# Altium schematic sheet TopLevel.SchDoc
size A4
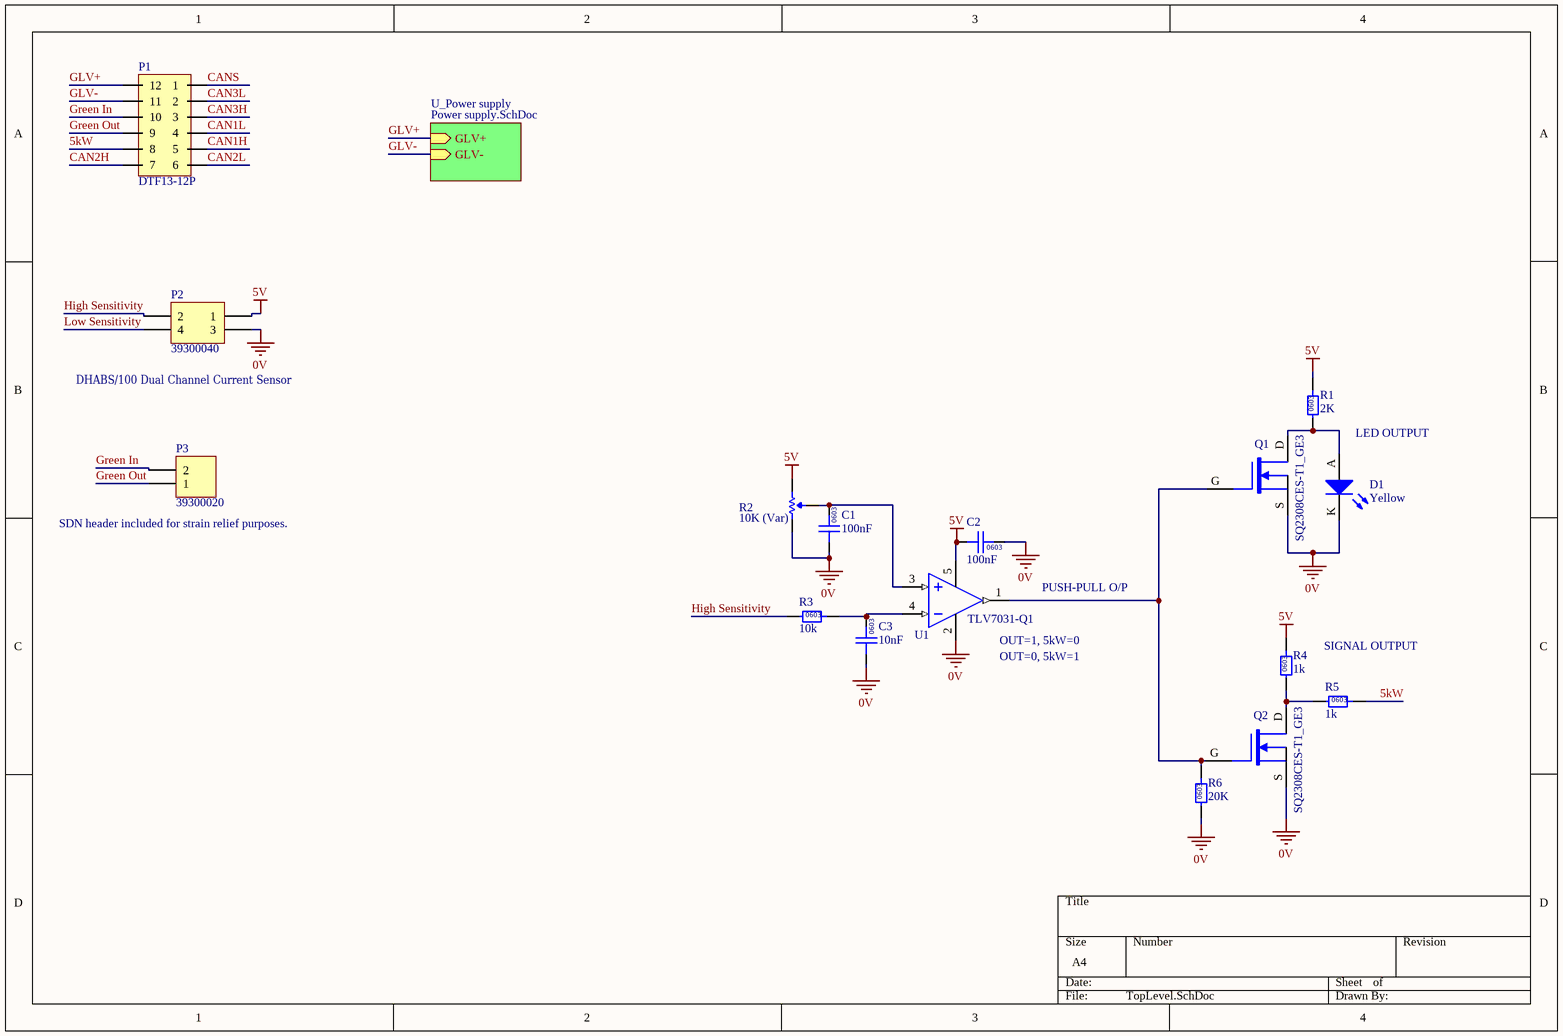
[diagram p0: TopLevel.SchDoc]

## Parts
C1  100nF  [0603]
C2  100nF  [0603]
C3  10nF  [0603]
D1  Yellow  [0805 LED]
P1  DTF13-12P  [DTF13-12P]
P2  39300040  [39300040]
P3  39300020  [39300020]
Q1  SQ2308CES-T1_GE3  [VSHY SOT-23-3]
Q2  SQ2308CES-T1_GE3  [VSHY SOT-23-3]
R1  2K  [0603]
R2  10K (Var)  [B 3296]
R3  10k  [0603]
R4  1k  [0603]
R5  1k  [0603]
R6  20K  [0603]
U1  TLV7031-Q1  [TI SOT-23-5]

## Sub-sheets
U_Power supply = Power supply.SchDoc: GLV+ (in), GLV- (in)

## Nets
0V: C1.1 C2.2 C3.1 D1.K P2.3 Q1.S Q2.S R2.3(CW) R6.1 U1.2(V-)
5V: C2.1 P2.1 R1.2 R2.1(CCW) R4.2 U1.5(Vcc)
5kW: P1.8 R5.2
CAN1H: P1.5
CAN1L: P1.4
CAN2H: P1.7
CAN2L: P1.6
CAN3H: P1.3
CAN3L: P1.2
CANS: P1.1
GLV+: P1.12 ; sheet U_Power supply/GLV+
GLV-: P1.11 ; sheet U_Power supply/GLV-
Green In: P1.10 P3.2
Green Out: P1.9 P3.1
High Sensitivity: P2.2 R3.1
Low Sensitivity: P2.4
NetC1_2: C1.2 R2.2(Wiper) U1.3(IN+)
NetC3_2: C3.2 R3.2 U1.4(IN-)
NetD1_A: D1.A Q1.D R1.1
NetQ1_G: Q1.G Q2.G R6.2 U1.1(OUT)
NetQ2_D: Q2.D R4.1 R5.1

## Notes on the sheet
- (near P2) DHAB​​S/100 Dual Channel Current Sensor
- LED OUTPUT
- (near P3) SDN header included for strain relief purposes.
- (near U1) OUT=1, 5kW=0
- PUSH-PULL O/P
- SIGNAL OUTPUT
- (near U1) OUT=0, 5kW=1
- (in symbol GCM188L81H103KA03D) 0603
- (in symbol GCM188L81H104KA57D) 0603
- (in symbol RC0603FR-071KL) 0603
- (in symbol RC0603FR-072KL) 0603
- (in symbol RC0603FR-0710KL) 0603
- (in symbol RC0603FR-0720KL) 0603

## Library data of the parts
C1 C2 = GCM188L81H104KA57D: Manufacturer: muRata; Rated Voltage: 50V; Tolerance: ±10%; Material: MLCC; Temperature Rating: X8L; Part Number: GCM188L81H104KA57D; Value: 100nF; Digikey Part Number: 490-6049-1-ND
C3 = GCM188L81H103KA03D: Manufacturer: muRata; Rated Voltage: 50V; Tolerance: ±10%; Material: MLCC; Temperature Rating: X8L; Part Number: GCM188L81H103KA03D; Value: 10nF; Digikey Part Number: 490-GCM188L81H103KA03DCT-ND
D1 = SML-211YTT86: Yellow LED Indication - Discrete 1.75V 0805 (2012 Metric); Manufacturer: ROHM Semiconductor; Part Number: SML-211YTT86; Colour: Yellow; Digikey Part Number: 511-1293-1-ND
P1 = DTF13-12P: Positions: 12; Pitch: 4.45mm; Angle: 90; Flange: No; Contact: Copper Alloy; Part Number: DTF13-12P; Row Spacing: 4.45mm; Digikey Part Number: 1734-1861-ND; Digikey Link: https://www.digikey.com/products/en?keywords=dtf13-12pa
P2 = 39300040: Pitch: 4.2mm; Row Spacing: 5.5mm; Angle: 90; Flange: No; Contact: Tin; Part Number: 39300040; Positions: 4; Digikey Part Number: WM21352-ND
P3 = 39300020: Pitch: 4.2mm; Row Spacing: 5.5mm; Angle: 90; Flange: No; Contact: Tin; Part Number: 39300020; Positions: 2; Digikey Part Number: WM21351-ND
Q1 Q2 = SQ2308CES-T1_GE3: MOSFET N-CH 60V 2.3A SOT23; Manufacturer: Vishay Siliconix; Type: N-channel; Rated Power: 2W; Published: 24-Mar-1999; LatestRevisionDate: 29-May-2009; LatestRevisionNote: IPC-7351 Footprint Added.; PackageVersion: Sep-2000; PackageReference: SOT-343; Publisher: Altium Limited; PackageDescription: 4-Pin SOT-343 Package 1.3 mm Pitch, 2.1 mm Lead Span; Part Number: SQ2308CES-T1_GE3; Digikey Part Number: SQ2308CES-T1_GE3CT-ND
R1 = RC0603FR-072KL: Manufacturer: YAGEO; Tolerance: 0.01; Rated Power: 0.1W; Part Number: RC0603FR-072KL; Value: 2K; Digikey Part Number: 311-2.00KHRCT-ND
R2 = 3296W-1-103LF: Manufacturer: Bournes Inc; Tolerance: 0.1; Rated Power: 0.5W; Part Number: 3296W-1-103LF; Value: 10K (Var); Digikey Part Number: 3296W-103LF-ND
R3 = RC0603FR-0710KL: Manufacturer: YAGEO; Tolerance: 0.01; Rated Power: 0.1W; Part Number: RC0603FR-0710KL; Value: 10k; Digikey Part Number: 311-10.0KHRCT-ND
R4 R5 = RC0603FR-071KL: Manufacturer: YAGEO; Tolerance: 0.01; Rated Power: 0.1W; Part Number: RC0603FR-071KL; Value: 1k; Digikey Part Number: 311-1.00KHRCT-ND
R6 = RC0603FR-0720KL: Manufacturer: YAGEO; Tolerance: 0.01; Rated Power: 0.1W; Part Number: RC0603FR-0720KL; Value: 20K; Digikey Part Number: 311-20.0KHRCT-ND
U1 = TLV7031-Q1: Manufacturer: Texas Instruments; Input Voltage: 1.6 to 6.5 V; Channels: 1; Output: Push-Pull; Part Number: TLV7031-Q1; Digikey Part Number: 296-TLV7031QDBVRQ1CT-ND